# Altium schematic sheet 拓空者P2IMU模块接口原理图.SchDoc
size A4
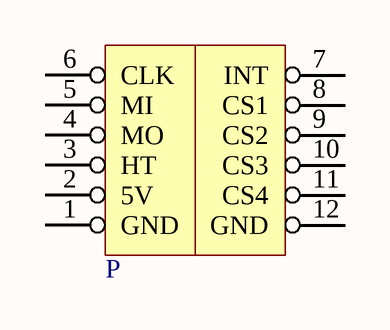
[diagram p0: 拓空者P2IMU模块接口原理图.SchDoc]

## Parts
P  IMU_TKZ  [IMU_TKZ_SM]  (value not drawn)

## Nets

Not connected (* = marked no-connect by the designer): P 1(GND) 2(5V) 3(HT) 4(MO) 5(MI) 6(CLK) 7(INT) 8(CS1) 9(CS2) 10(CS3) 11(CS4) 12(GND)